# EasyEDA Pro project ProPrj_Hitboard Pro v2.4 左上typec_2026-01-22.epro

# Board PCB1
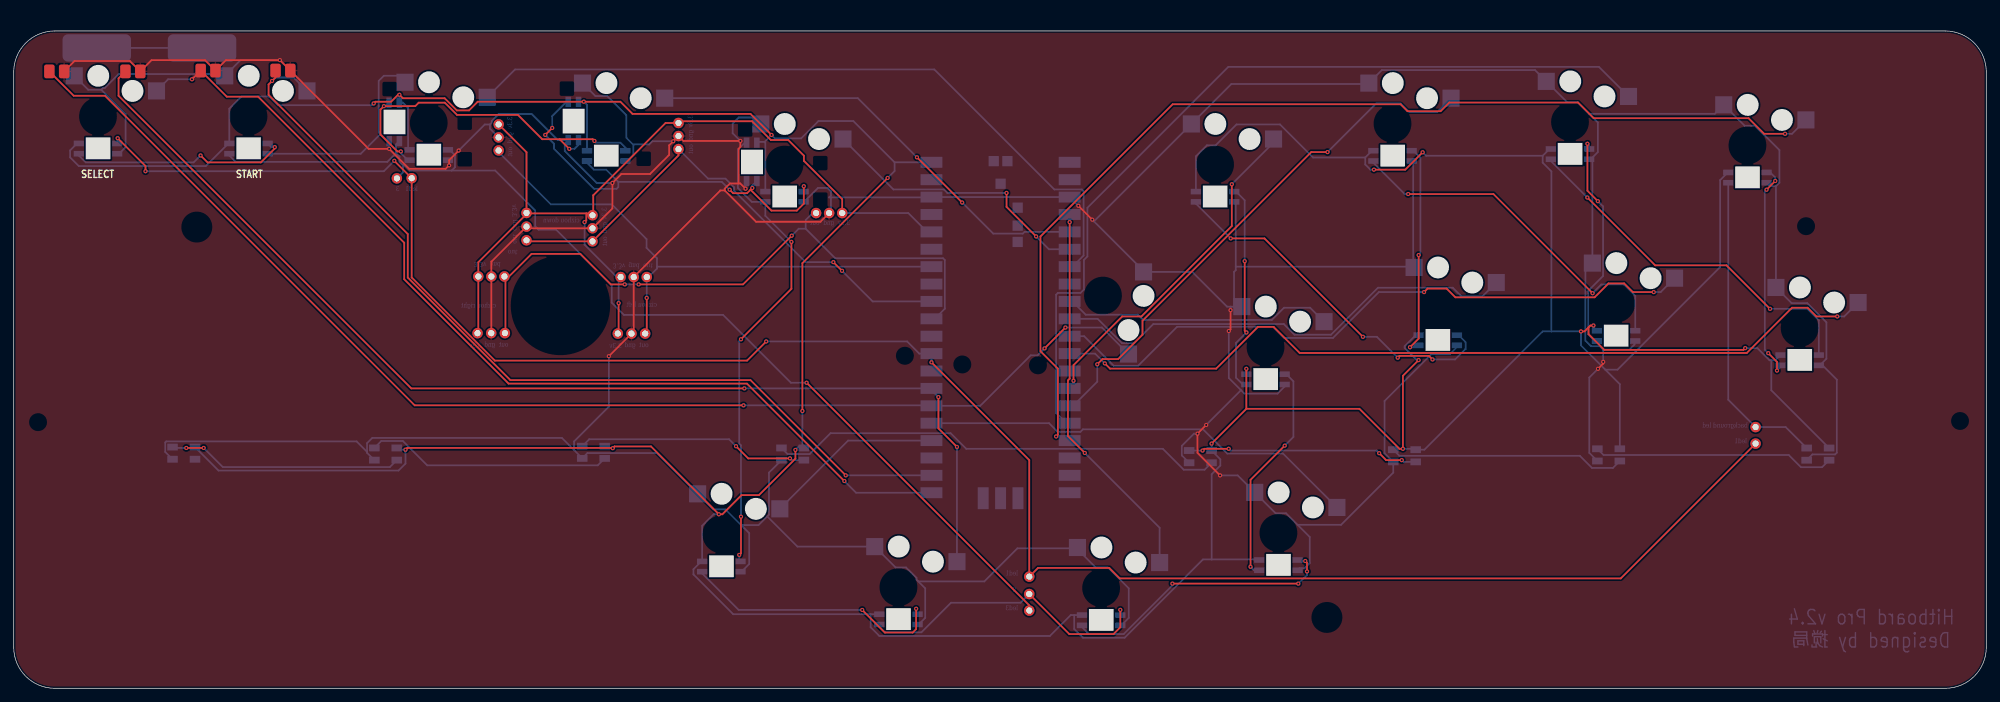
[diagram p0: board, top side]
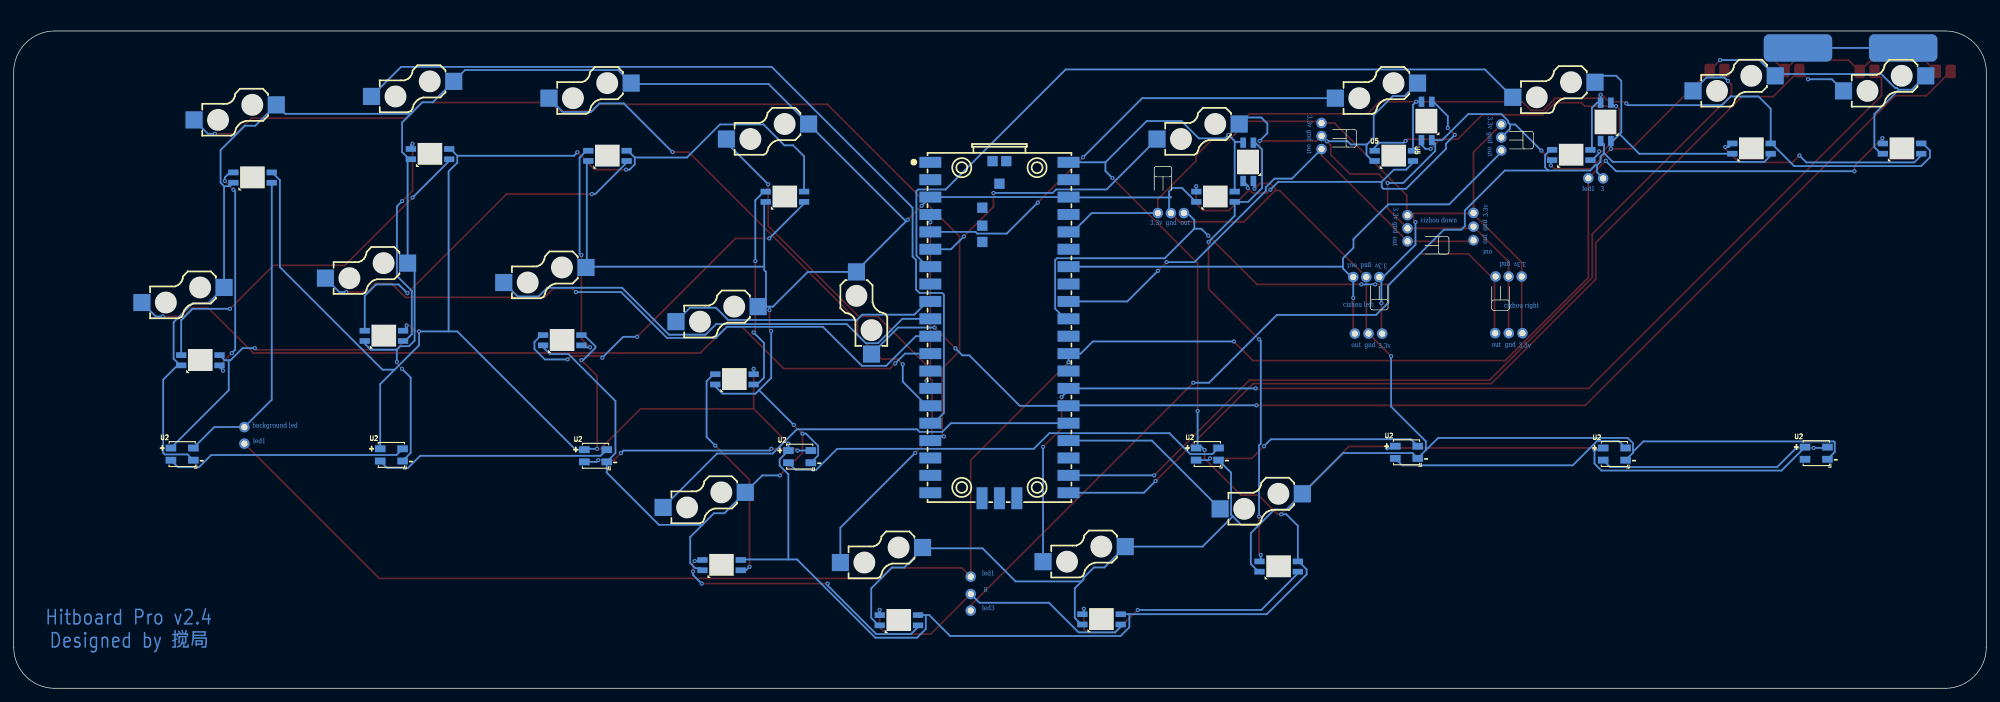
[diagram p1: board, bottom side, seen from below]

Outline 288 x 96 mm; copper layers: Top Layer, Bottom Layer. Coordinates in mm from the lower left corner of the outline.
Outline path: 0,90 arc(1.76,94.24) 6,96 282,96 arc(286.24,94.24) 288,90 288,6 arc(286.24,1.76) 282,0 6,0 arc(1.76,1.76) 0,6 0,90
Stack: Top Layer 0.035mm / Dielectric1 1.51mm FR4 er 4.5 / Bottom Layer 0.035mm

## Design rules (mm)
template: JLCPCB Capability(Two Layers Board)
spacing copperThickness1oz (default): track to track 0.102, other pairs 0.152 to 0.3
spacing copperThickness2oz: track to track 0.203, other pairs 0.152 to 0.3
track width copperThickness1oz (default): min 0.127, default 0.254, max 2.54
track width copperThickness2oz: min 0.203, default 0.254, max 2.54
differential pair differentialPair (default): width min 0.127, default 0.254, max 2.54; gap min 0.152, default 0.152
via viaSize (default): diameter min 0.5, default 0.61, max 10; hole min 0.3, default 0.305, max 6.3

## Placement (name value [footprint] x y rotation side)
NOREF  -  [Pad_e44]  16.32 90.09 0 top
NOREF#2  -  [Pad_e8275]  148.27 13.77 90 top
NOREF#3  -  [Pad_e1080]  119.05 69.4 0 top
NOREF#4  -  [Pad_e81]  27.3 90.22 0 top
NOREF#5  -  [Pad_e77]  67.83 60.14 180 top
NOREF#6  -  [Pad_e71]  88.62 60.06 180 top
NOREF#7  -  [Pad_e115]  97.06 82.56 90 top
NOREF#8  -  [Pad_e7360]  74.87 65.43 270 top
NOREF#9  -  [Pad_e16564]  12.13 93.52 0 top
NOREF#10  -  [Pad_e24566]  58.1 74.5 90 top
NOREF#11  -  [Pad_e79]  71.64 60.14 180 top
NOREF#12  -  [Pad_e7348]  92.19 51.81 0 top
NOREF#13  -  [Pad_e72]  92.43 60.06 180 top
NOREF#14  -  [Pad_e7347]  90.2 51.81 0 top
NOREF#15  -  [Pad_e7353]  69.72 51.87 0 top
NOREF#16  -  [Pad_e56]  7.37 90.09 0 top
NOREF#17  -  [Pad_e117]  97.06 78.75 90 top
NOREF#18  -  [Pad_e116]  97.06 80.66 90 top
NOREF#19  -  [Pad_e121]  70.8 82.36 90 top
NOREF#20  -  [Pad_e8276]  254.32 38.15 90 top
NOREF#21  -  [Pad_e73]  90.52 60.06 180 top
NOREF#22  -  [Pad_e17942]  148.27 11.35 90 top
NOREF#23  -  [Pad_e123]  70.8 78.55 90 top
NOREF#24  -  [Pad_e7361]  74.87 69.42 270 top
NOREF#25  -  [Pad_e7354]  71.71 51.87 0 top
NOREF#26  -  [Pad_e83]  38.23 90.22 0 top
NOREF#27  -  [Pad_e8795]  254.32 35.74 90 top
NOREF#28  -  [Pad_e65]  84.51 67.18 90 top
NOREF#29  -  [Pad_e8272]  55.94 74.47 90 top
NOREF#30  -  [Pad_e78]  69.74 60.14 180 top
NOREF#31  -  [Pad_e122]  70.8 80.45 90 top
NOREF#32  -  [Pad_e7359]  74.87 67.43 270 top
NOREF#33  -  [Pad_e67]  5.21 90.09 0 top
NOREF#34  -  [Pad_e1081]  117.15 69.4 0 top
NOREF#35  -  [Pad_e64]  84.51 65.28 90 top
NOREF#36  -  [Pad_e82]  40.39 90.22 0 top
NOREF#37  -  [Pad_e47]  18.48 90.09 0 top
NOREF#38  -  [Pad_e16566]  27.5 93.52 0 top
NOREF#39  -  [Pad_e7355]  67.72 51.87 0 top
NOREF#40  -  [Pad_e7349]  88.2 51.81 0 top
NOREF#41  -  [Pad_e32726]  148.27 16.31 90 top
NOREF#42  -  [Pad_e66]  84.51 69.09 90 top
NOREF#43  -  [Pad_e80]  29.46 90.22 0 top
NOREF#44  -  [Pad_e1079]  120.96 69.4 0 top
U1  PICO  [COMM-SMD_L51.0-W21.0-P2.54_SC0916]  144.08 52.37 270 bottom
U2  -  [LED-SMD_4P-L3.5-W3.5-TL_WS2812B]  203.05 33.96 180 bottom
U2#2  -  [LED-SMD_4P-L3.5-W3.5-TL_WS2812B]  232.86 34.09 180 bottom
U2#3  -  [LED-SMD_4P-L3.5-W3.5-TL_WS2812B]  173.25 33.83 180 bottom
U2#4  -  [LED-SMD_4P-L3.5-W3.5-TL_WS2812B]  113.73 34.21 180 bottom
U2#5  -  [LED-SMD_4P-L3.5-W3.5-TL_WS2812B]  84.65 34.47 180 bottom
U2#6  -  [LED-SMD_4P-L3.5-W3.5-TL_WS2812B]  54.29 34.21 180 bottom
U2#7  -  [LED-SMD_4P-L3.5-W3.5-TL_WS2812B]  24.83 34.34 180 bottom
U2#8  -  [LED-SMD_4P-L3.5-W3.5-TL_WS2812B]  263.41 34.2 180 bottom
U5  -  [LED-SMD_L3.2-W2.8_YO-WS2812B-3528]  60.59 77.89 180 bottom
U5#2  -  [LED-SMD_L3.2-W2.8_YO-WS2812B-3528]  86.5 77.76 180 bottom
U5#3  -  [LED-SMD_L3.2-W2.8_YO-WS2812B-3528]  112.54 71.79 180 bottom
U5#4  -  [LED-SMD_L3.2-W2.8_YO-WS2812B-3528]  103.31 17.78 180 bottom
U5#5  -  [LED-SMD_L3.2-W2.8_YO-WS2812B-3528]  129.17 10.07 180 bottom
U5#6  -  [LED-SMD_L3.2-W2.8_YO-WS2812B-3528]  158.77 9.94 180 bottom
U5#7  -  [LED-SMD_L3.2-W2.8_YO-WS2812B-3528]  184.65 17.99 180 bottom
U5#8  -  [LED-SMD_L3.2-W2.8_YO-WS2812B-3528]  175.4 71.79 180 bottom
U5#9  -  [LED-SMD_L3.2-W2.8_YO-WS2812B-3528]  182.77 45.12 180 bottom
U5#10  -  [LED-SMD_L3.2-W2.8_YO-WS2812B-3528]  201.31 77.76 180 bottom
U5#11  -  [LED-SMD_L3.2-W2.8_YO-WS2812B-3528]  207.91 50.84 180 bottom
U5#12  -  [LED-SMD_L3.2-W2.8_YO-WS2812B-3528]  227.22 78.01 180 bottom
U5#13  -  [LED-SMD_L3.2-W2.8_YO-WS2812B-3528]  233.95 51.47 180 bottom
U5#14  -  [LED-SMD_L3.2-W2.8_YO-WS2812B-3528]  260.75 47.92 180 bottom
U5#15  -  [LED-SMD_L3.2-W2.8_YO-WS2812B-3528]  253.13 74.59 180 bottom
U5#16  -  [LED-SMD_L3.2-W2.8_YO-WS2812B-3528]  107.75 76.89 90 bottom
U5#17  -  [LED-SMD_L3.2-W2.8_YO-WS2812B-3528]  81.71 82.85 90 bottom
U5#18  -  [LED-SMD_L3.2-W2.8_YO-WS2812B-3528]  55.56 82.73 90 bottom
U5#19  -  [LED-SMD_L3.2-W2.8_YO-WS2812B-3528]  12.31 78.82 180 bottom
U5#20  -  [LED-SMD_L3.2-W2.8_YO-WS2812B-3528]  34.28 78.82 180 bottom
U6  -  [CONN-SMD_HOTPLUGPAKAGE__C9900010116-1]  89.04 87.29 180 bottom
U6#2  -  [CONN-SMD_HOTPLUGPAKAGE__C9900010116-1]  115.08 81.32 180 bottom
U6#3  -  [CONN-SMD_HOTPLUGPAKAGE__C9900010116-1]  105.85 27.31 180 bottom
U6#4  -  [CONN-SMD_HOTPLUGPAKAGE__C9900010116-1]  131.71 19.59 180 bottom
U6#5  -  [CONN-SMD_HOTPLUGPAKAGE__C9900010116-1]  161.31 19.47 180 bottom
U6#6  -  [CONN-SMD_HOTPLUGPAKAGE__C9900010116-1]  187.19 27.51 180 bottom
U6#7  -  [CONN-SMD_HOTPLUGPAKAGE__C9900010116-1]  163.86 54.81 90 bottom
U6#8  -  [CONN-SMD_HOTPLUGPAKAGE__C9900010116-1]  177.94 81.32 180 bottom
U6#9  -  [CONN-SMD_HOTPLUGPAKAGE__C9900010116-1]  185.31 54.65 180 bottom
U6#10  -  [CONN-SMD_HOTPLUGPAKAGE__C9900010116-1]  203.85 87.29 180 bottom
U6#11  -  [CONN-SMD_HOTPLUGPAKAGE__C9900010116-1]  210.45 60.36 180 bottom
U6#12  -  [CONN-SMD_HOTPLUGPAKAGE__C9900010116-1]  229.76 87.54 180 bottom
U6#13  -  [CONN-SMD_HOTPLUGPAKAGE__C9900010116-1]  236.49 61 180 bottom
U6#14  -  [CONN-SMD_HOTPLUGPAKAGE__C9900010116-1]  263.29 57.44 180 bottom
U6#15  -  [CONN-SMD_HOTPLUGPAKAGE__C9900010116-1]  255.67 84.11 180 bottom
U6#16  -  [CONN-SMD_HOTPLUGPAKAGE__C9900010116-1]  14.85 88.35 180 bottom
U6#17  -  [CONN-SMD_HOTPLUGPAKAGE__C9900010116-1]  36.82 88.35 180 bottom
U6#18  -  [CONN-SMD_HOTPLUGPAKAGE__C9900010116-1]  63.13 87.41 180 bottom

## Footprints (pads in the part's own frame, mm; a bottom-side part is the same pattern mirrored in y, then rotated)
COMM-SMD_L51.0-W21.0-P2.54_SC0916
  rect 1.6x3.2 smd: 1(-24.445,-10.088) 2(-21.905,-10.088) 3(-19.365,-10.088) 4(-16.825,-10.088) 5(-14.285,-10.088) 6(-11.745,-10.088) 7(-9.205,-10.088) 8(-6.665,-10.088) 9(-4.125,-10.088) 10(-1.585,-10.088) 11(0.955,-10.088) 12(3.495,-10.088) 13(6.035,-10.088) 14(8.575,-10.088) 15(11.115,-10.088) 16(13.655,-10.088) 17(16.195,-10.088) 18(18.735,-10.088) 19(21.275,-10.088) 20(23.815,-10.088) 21(23.815,10.088) 22(21.275,10.088) 23(18.735,10.088) 24(16.195,10.088) 25(13.655,10.088) 26(11.115,10.088) 27(8.575,10.088) 28(6.035,10.088) 29(3.495,10.088) 30(0.955,10.088) 31(-1.585,10.088) 32(-4.125,10.088) 33(-6.665,10.088) 34(-9.205,10.088) 35(-11.745,10.088) 36(-14.285,10.088) 37(-16.825,10.088) 38(-19.365,10.088) 39(-21.905,10.088) 40(-24.445,10.088)
  rect 3.2x1.6 smd: 41(24.615,-2.54) 42(24.615,0) 43(24.615,2.54)
  rect 1.5x1.5 smd: TP1(-21.315,0) TP2(-24.615,1) TP3(-24.615,-1) TP4(-17.815,-2.5) TP5(-15.188,-2.5) TP6(-12.815,-2.5)
CONN-SMD_HOTPLUGPAKAGE__C9900010116-1
  rect 2.5x2.5 smd: 1(-6,-1.1) 2(6,1.1)
LED-SMD_4P-L3.5-W3.5-TL_WS2812B
  rect 1.545x0.997 smd: 1(-1.637,0.89) 2(-1.637,-0.89) 3(1.637,-0.89) 4(1.637,0.89)
LED-SMD_L3.2-W2.8_YO-WS2812B-3528
  rect 1.5x0.82 smd: 1(2.8,0.75) 2(2.8,-0.75) 3(-2.8,-0.75) 4(-2.8,0.75)
Pad_e44
  rrect 1.524x2 smd: 1(0,0)
Pad_e47
  rrect 1.524x2 smd: 1(0,0)
Pad_e56
  rrect 1.524x2 smd: 1(0,0)
Pad_e64
  round 1.524 hole 0.914: 3(0,0)
Pad_e65
  round 1.524 hole 0.914: 2(0,0)
Pad_e66
  round 1.524 hole 0.914: 1(0,0)
Pad_e67
  rrect 1.524x2 smd: 1(0,0)
Pad_e71
  round 1.524 hole 0.914: 1(0,0)
Pad_e72
  round 1.524 hole 0.914: 3(0,0)
Pad_e73
  round 1.524 hole 0.914: 2(0,0)
Pad_e77
  round 1.524 hole 0.914: 1(0,0)
Pad_e78
  round 1.524 hole 0.914: 2(0,0)
Pad_e79
  round 1.524 hole 0.914: 3(0,0)
Pad_e80
  rrect 1.524x2 smd: 1(0,0)
Pad_e81
  rrect 1.524x2 smd: 1(0,0)
Pad_e82
  rrect 1.524x2 smd: 1(0,0)
Pad_e83
  rrect 1.524x2 smd: 1(0,0)
Pad_e115
  round 1.524 hole 0.914: 1(0,0)
Pad_e116
  round 1.524 hole 0.914: 2(0,0)
Pad_e117
  round 1.524 hole 0.914: 3(0,0)
Pad_e121
  round 1.524 hole 0.914: 1(0,0)
Pad_e122
  round 1.524 hole 0.914: 2(0,0)
Pad_e123
  round 1.524 hole 0.914: 3(0,0)
Pad_e1079
  round 1.524 hole 0.914: 1(0,0)
Pad_e1080
  round 1.524 hole 0.914: 2(0,0)
Pad_e1081
  round 1.524 hole 0.914: 3(0,0)
Pad_e7347
  round 1.524 hole 0.914: 2(0,0)
Pad_e7348
  round 1.524 hole 0.914: 3(0,0)
Pad_e7349
  round 1.524 hole 0.914: 1(0,0)
Pad_e7353
  round 1.524 hole 0.914: 2(0,0)
Pad_e7354
  round 1.524 hole 0.914: 3(0,0)
Pad_e7355
  round 1.524 hole 0.914: 1(0,0)
Pad_e7359
  round 1.524 hole 0.914: 2(0,0)
Pad_e7360
  round 1.524 hole 0.914: 3(0,0)
Pad_e7361
  round 1.524 hole 0.914: 1(0,0)
Pad_e8272
  round 1.524 hole 0.914: 2(0,0)
Pad_e8275
  round 1.524 hole 0.914: 2(0,0)
Pad_e8276
  round 1.524 hole 0.914: 2(0,0)
Pad_e8795
  round 1.524 hole 0.914: 2(0,0)
Pad_e16564
  rrect 10x4 smd far side: 1(0,0)
Pad_e16566
  rrect 10x4 smd far side: 1(0,0)
Pad_e17942
  round 1.524 hole 0.914: 2(0,0)
Pad_e24566
  round 1.524 hole 0.914: 2(0,0)
Pad_e32726
  round 1.524 hole 0.914: 2(0,0)

## Nets
3.3V: NOREF#5.1 NOREF#6.1 NOREF#7.1 NOREF#19.1 NOREF#24.1 NOREF#39.1 NOREF#40.1 NOREF#42.1 NOREF#44.1 U1.36
GND: NOREF#3.2 NOREF#14.2 NOREF#15.2 NOREF#16.1 NOREF#18.2 NOREF#21.2 NOREF#28.2 NOREF#30.2 NOREF#31.2 NOREF#32.2 NOREF#36.1 NOREF#37.1 NOREF#43.1 U1.3 U1.38 U2.3 U2#2.3 U2#3.3 U2#4.3 U2#5.3 U2#6.3 U2#7.3 U2#8.3 U5.3 U5#2.3 U5#3.3 U5#4.3 U5#5.3 U5#6.3 U5#7.3 U5#8.3 U5#9.3 U5#10.3 U5#11.3 U5#12.3 U5#13.3 U5#14.3 U5#15.3 U5#16.3 U5#17.3 U5#18.3 U5#19.3 U5#20.3 U6.2 U6#2.2 U6#3.2 U6#4.2 U6#5.2 U6#6.2 U6#7.2 U6#8.2 U6#9.2 U6#10.2 U6#11.2 U6#12.2 U6#13.2 U6#14.2 U6#15.2 U6#16.2 U6#17.2 U6#18.2
VCC: U1.40 U2.1 U2#2.1 U2#3.1 U2#4.1 U2#5.1 U2#6.1 U2#7.1 U2#8.1 U5.1 U5#2.1 U5#3.1 U5#4.1 U5#5.1 U5#6.1 U5#7.1 U5#8.1 U5#9.1 U5#10.1 U5#11.1 U5#12.1 U5#13.1 U5#14.1 U5#15.1 U5#16.1 U5#17.1 U5#18.1 U5#19.1 U5#20.1
2: U5#19.2 U5#20.4
3: NOREF#22.2 NOREF#29.2 U5.4 U5#18.4 U5#20.2
4: U5.2 U5#2.4 U5#17.4 U5#18.2
5: U5#2.2 U5#3.4 U5#16.4 U5#17.2
6: U5#3.2 U5#4.4 U5#16.2
7: U5#4.2 U5#5.4
8: NOREF#2.2 U5#5.2 U5#6.4
9: U5#6.2 U5#7.4
10: U5#7.2 U5#9.4
11: U5#8.4 U5#9.2
12: U5#8.2 U5#11.4
13: U5#10.4 U5#11.2
14: U5#10.2 U5#13.4
15: U5#12.4 U5#13.2
16: U5#12.2 U5#14.4
17: U5#14.2 U5#15.4
18: NOREF#20.2 U2#8.4 U5#15.2
19: U2#2.4 U2#8.2
20: U2.4 U2#2.2
21: U2.2 U2#3.4
22: U2#3.2 U2#4.4
23: U2#4.2 U2#5.4
24: U2#5.2 U2#6.4
25: U2#6.2 U2#7.4
26: U2#7.2
A: U1.9 U6#9.1
B: U1.10 U6#11.1
CAPTURE: NOREF.1 U1.27 U6#4.1
CI_DOWN: NOREF#8.3 NOREF#17.3 NOREF#35.3 U1.32
CI_LEFT: NOREF#12.3 NOREF#13.3 NOREF#23.3 U1.34
CI_RIGHT: NOREF#11.3 NOREF#25.3 NOREF#34.3 U1.31
DOWN: U1.5 U6.1
GUDING1: NOREF#9.1 NOREF#38.1
HOME: NOREF#33.1 U1.26 U6#7.1
L3: U1.24 U6#3.1
LB: U1.17 U6#15.1
LED1: NOREF#10.2 NOREF#27.2 NOREF#41.2 U1.29 U5#19.4
LEFT: U1.7 U6#18.1
LT: U1.12 U6#14.1
R3: U1.25 U6#6.1
RB: U1.16 U6#12.1
RIGHT: U1.6 U6#2.1
RT: U1.11 U6#13.1
SELECT: NOREF#4.1 U1.21 U6#16.1
START: NOREF#26.1 U1.22 U6#17.1
UP: U1.4 U6#5.1
X: U1.14 U6#8.1
Y: U1.15 U6#10.1

Pads without a net: U1 1 2 8 13 18 19 20 23 28 30 33 35 37 39 41 42 43 TP1 TP2 TP3 TP4 TP5 TP6

## Via types
v1: diameter 0.61, hole 0.305, Top Layer to Bottom Layer, 127 vias

## Routing (per net, layer and track width the routed paths; a pad name or vN(x,y) marks a point on that pad's centre or on a via; arc(x,y) is an arc through that point)
3.3V: length 130.2
  Top Layer w0.254: 84.61,69.35 83.6,69.35 ; 84.61,69.35 84.61,69.2 NOREF#42.1 ; 84.61,69.35 84.61,72 95.18,82.56 NOREF#7.1 97.31,82.82 107.8,82.82 110.55,80.07 113.09,80.07 115.37,77.79 115.37,77.02 120.96,71.44 NOREF#44.1 ; 83.6,69.35 83.6,68.34 v1(83.34,68.08) ; 83.6,69.35 74.96,69.35 ; NOREF#40.1 88.32,51.92 v1(88.32,56.25) ; 74.96,69.35 NOREF#24.1 74.87,78.29 NOREF#19.1 ; 74.96,69.35 67.83,62.22 NOREF#5.1 67.83,51.98 NOREF#39.1
  Bottom Layer w0.254: 88.32,60.06 88.07,60.06 83.34,64.78 v1(83.34,68.08) ; 88.32,60.06 v1(88.32,56.25) ; 88.32,60.06 NOREF#6.1 ; NOREF#44.1 130.61,69.4 133.36,66.66 U1.36
GND: length 1010.9
  Top Layer w0.254: 105.84,73.72 104.57,73.72 103.81,72.96 103.81,72.71 ; 105.84,73.72 106.09,73.72 v1(106.85,72.96) ; 105.84,73.72 105.84,78.8 106.09,79.06 v1(106.09,79.94) 97.78,79.94 NOREF#18.2 v1(96.3,79.89) 95.7,79.29 95.7,77.9 92.9,75.11 88.72,75.11 v1(87.41,73.8) 87.41,70.08 NOREF#28.2 75.12,67.18 NOREF#32.2 69.74,62.3 NOREF#30.2 69.74,51.89 NOREF#15.2 ; v1(231.31,46.66) 232.07,47.42 v1(232.07,47.67) ; v1(174.1,38.46) v1(172.83,37.19) 172.83,34.4 v1(176.13,31.09) ; v1(177.66,55.22) 177.66,52.43 v1(177.41,52.18) ; 103.81,72.71 103.17,72.71 NOREF#21.2 90.52,52.13 NOREF#14.2 v1(86.9,48.5) ; 103.81,72.71 108.38,68.13 117.78,68.13 NOREF#3.2 ; v1(155.44,70.47) v1(157.47,68.44) ; v1(64.96,78.53) 63.57,77.14 v1(63.57,76.38) 63.06,75.87 57.73,75.87 v1(54.81,78.78) 51.83,78.78 NOREF#36.1 v1(38.86,91.74) 30.98,91.74 NOREF#43.1 27.93,91.74 20.13,91.74 NOREF#37.1 16.96,91.62 8.89,91.62 NOREF#16.1
  Bottom Layer w0.254: v1(106.09,79.94) 104.97,81.06 104.97,82.47 105.86,83.36 108.13,83.36 U6#2.2 ; 178.17,55.73 178.17,60.81 178.42,61.07 178.42,61.57 ; 178.17,55.73 179.29,55.73 U6#9.2 ; 178.17,55.73 177.66,55.73 ; 230.02,83.9 248.36,83.9 U6#15.2 252.71,82.16 254.24,82.16 257.79,78.61 257.79,73.84 257.29,73.33 ; 230.02,83.9 231.29,82.63 231.29,78.32 230.27,77.3 ; 230.02,83.9 228.33,85.59 226.81,85.59 U6#12.2 222.11,90.29 199.75,90.29 197.72,88.26 177.78,88.26 U6#8.2 157.73,68.2 157.73,68.18 ; 53.54,80.94 50.67,78.07 U5#20.3 ; 53.54,80.94 54.56,79.93 U5#18.3 v1(54.81,78.78) ; 53.54,80.94 53.29,81.2 53.29,88.71 54.04,89.46 56.19,89.46 57.13,88.51 ; U6#11.2 204.34,61.57 204.08,61.57 ; 69.53,82.34 69.79,82.59 69.79,82.85 70.8,83.86 75.63,83.86 79.44,80.05 U5#17.3 80.46,79.55 80.46,78.46 85.12,73.8 v1(87.41,73.8) ; 69.53,82.34 69.53,81.72 NOREF#31.2 ; 69.53,82.34 68.77,82.34 v1(64.96,78.53) ; 12.78,87.42 16.34,83.86 16.34,79.03 15.38,78.07 U5#19.3 ; 12.78,87.42 10.88,87.42 U6#16.2 ; 12.78,87.42 13.04,87.67 13.29,87.67 15.32,89.7 30.56,89.7 U6#17.2 33.11,91.74 v1(38.86,91.74) ; U5#7.3 187.73,17.53 188.46,17.53 189.22,18.29 189.22,22.1 187.44,23.88 ; 155.18,20.44 U6#5.2 ; 155.18,20.44 146.54,20.44 141.72,15.61 132.06,15.61 ; 155.18,20.44 157.97,17.65 159.75,17.65 162.8,14.6 162.8,10.28 161.71,9.19 U5#6.3 ; 119.31,71.69 119.05,71.69 119.32,71.96 119.32,72.57 118.81,73.08 117.43,73.08 115.54,71.18 115.48,71.18 U5#3.3 ; 119.31,71.69 119.32,71.68 119.32,69.67 NOREF#3.2 ; 119.31,71.69 133.95,71.69 U1.38 U1.3 v1(155.44,70.47) ; U5.3 63.57,76.96 v1(63.57,76.38) ; 179.18,43.54 177.41,45.32 v1(177.41,52.18) ; 179.18,43.54 v1(174.1,38.46) ; 179.18,43.54 179.69,43.03 184.52,43.03 185.57,44.08 U5#9.3 ; v1(157.47,68.44) 157.73,68.18 ; 157.73,68.18 164.96,60.95 U6#7.2 172.07,60.81 177.15,55.73 177.66,55.73 ; U2#3.3 170.55,34.01 170.55,35.41 172.33,37.19 v1(172.83,37.19) ; 263.89,47.36 263.75,47.36 U5#14.3 ; 263.89,47.36 264.65,48.13 264.65,53.46 261.86,56.25 259.57,56.25 U6#14.2 257.29,73.33 ; 263.89,47.36 266.18,45.08 266.18,34.41 265.92,34.16 262.61,34.16 U2#8.3 ; 177.66,55.73 v1(177.66,55.22) ; U5#16.3 106.85,73.94 v1(106.85,72.96) ; 132.06,15.61 133.08,14.6 133.08,10.28 132.12,9.32 U5#5.3 ; 132.06,15.61 131.81,15.87 131.81,16.12 130.29,17.65 128.76,17.65 U6#4.2 114.43,20.69 110.01,25.11 ; U2#6.3 51.59,34.39 51.59,34.53 ; 83.01,33.59 U2#5.3 ; 83.01,33.59 81.82,34.79 ; 83.01,33.59 83.77,34.36 93.91,34.36 U6#3.2 102.14,26.12 103.92,26.12 106.2,23.84 ; 90.49,79.35 90.49,77.89 89.61,77.01 U5#2.3 ; 90.49,79.35 90.49,79.43 92.78,79.43 93.25,79.89 v1(96.3,79.89) ; 90.49,79.35 89.44,80.4 89.44,83.7 86.65,86.5 84.93,86.5 U6.2 ; v1(176.13,31.09) 178.7,31.09 U6#6.2 184.23,25.57 185.76,25.57 187.44,23.88 ; 51.59,34.53 50.07,36.06 22.27,36.06 22.13,35.91 22.13,34.52 U2#7.3 ; 51.59,34.53 51.59,35.8 52.35,36.57 80.04,36.57 81.82,34.79 ; 106.2,23.84 108.74,23.84 110.01,25.11 ; 106.2,23.84 107.38,22.66 107.38,18.16 106.26,17.03 U5#4.3 ; 178.42,61.57 204.08,61.57 ; 178.42,61.57 178.42,70.82 U5#8.3 ; 110.01,25.11 110.27,25.36 110.27,31.5 U2#4.3 ; 230.27,77.3 230.05,77.3 U5#12.3 ; 230.27,77.3 230.49,77.08 U6#13.2 229.47,61.08 229.47,50.78 230.29,49.96 231.56,49.96 232.07,49.45 ; U2#2.3 230.04,34.38 230.04,45.39 v1(231.31,46.66) ; 232.07,49.45 v1(232.07,47.67) ; 232.07,49.45 235.88,49.45 236.64,50.21 236.64,50.61 U5#13.3 ; 187.44,23.88 193.8,23.88 201.41,31.5 U2.3 200.15,34.34 200.15,41.96 207,48.82 209.7,48.82 210.71,49.83 U5#11.3 ; U5#10.3 204.33,76.79 204.33,61.83 204.08,61.57 ; 81.82,34.79 81.82,36.06 86.9,41.14 v1(86.9,48.5) ; 257.29,73.33 256.43,73.33 U5#15.3
VCC: length 741.6
  Top Layer w0.254: v1(52.56,85.41) 52.81,85.67 55.1,85.67 56.11,86.68 v1(56.31,86.68) 56.82,86.18 62.92,86.18 64.7,84.4 66.47,84.4 67.74,85.67 v1(83.24,85.67) 88.57,85.67 90.35,83.89 107.57,83.89 v1(110.64,80.81) ; v1(127.59,74.53) 115.15,62.09 v1(115.15,40.5) ; v1(230.64,52.98) 230.19,52.98 229.94,52.73 ; 229.94,52.73 229.94,51.71 232.22,49.43 252.54,49.43 v1(252.8,49.68) ; 229.94,52.73 229.33,52.12 v1(228.82,52.12) ; 179.97,40.82 v1(179.97,46.66) ; 179.97,40.82 v1(174.89,35.74) ; 179.97,40.82 196.48,40.82 202.32,34.98 v1(202.83,34.98) 202.83,45.64 v1(205.11,47.93) ; v1(57.2,34.85) 57.45,35.1 87.43,35.1 v1(87.46,35.07) 87.72,35.32 93.05,35.32 v1(102.96,25.42) 103.46,25.42 106.26,28.21 108.8,28.21 114.13,33.54 v1(114.13,34.81) ; v1(198.59,75.74) 203.17,75.74 v1(205.71,78.28)
  Bottom Layer w0.254: v1(56.31,86.68) U5#18.1 56.82,85.53 57.58,84.77 57.58,78.85 U5.1 ; U5#7.1 181.76,18.82 174.9,18.82 ; 197.32,77.52 197.32,76.51 198.09,75.74 v1(198.59,75.74) ; 197.32,77.52 189.7,77.52 184.88,82.35 178.53,82.35 175.48,79.3 174.21,79.3 172.6,77.69 U5#8.1 ; 197.32,77.52 198.31,78.51 U5#10.1 ; 115.15,35.32 114.64,35.32 v1(114.13,34.81) ; 115.15,35.32 U2#4.1 ; 115.15,35.32 v1(115.15,40.5) ; v1(174.89,35.74) U2#3.1 176.17,33.44 176.17,32.54 174.9,31.27 174.9,18.82 ; 128.61,76.82 U1.40 ; 128.61,76.82 122.58,82.85 117.5,82.85 114.96,80.31 111.15,80.31 v1(110.64,80.81) 109.63,79.8 ; 128.61,76.82 128.61,75.55 v1(127.59,74.53) ; U2#7.1 29.9,31.8 56.18,31.8 57.2,32.82 v1(57.2,34.85) 56.18,34.85 U2#6.1 ; U5#3.1 109.74,79.69 109.63,79.8 ; U5#19.1 9.25,79.57 8.24,78.56 8.24,77.54 9.51,76.27 28.05,76.27 31.35,79.57 U5#20.1 31.48,84.65 33.25,86.43 37.32,86.43 38.59,85.16 52.3,85.16 v1(52.56,85.41) ; U2#5.1 86.57,35.07 v1(87.46,35.07) ; 154.83,10.69 154.33,10.69 151.28,7.64 126.39,7.64 125.12,8.91 125.12,10.82 ; 154.83,10.69 154.83,8.66 156.1,7.39 162.2,7.39 173.63,18.82 174.9,18.82 ; 154.83,10.69 U5#6.1 ; 232.38,46.53 234.15,46.53 249.14,61.52 249.14,74.22 250.04,75.12 250.11,75.12 U5#15.1 ; 232.38,46.53 228.82,50.09 v1(228.82,52.12) 224.5,52.12 ; 232.38,46.53 234.49,44.42 U2#2.1 ; v1(205.71,78.28) 206.21,77.78 223.23,77.78 ; U5#13.1 230.64,52.73 v1(230.64,52.98) ; 256.61,47.9 257.18,47.9 U5#14.1 ; 256.61,47.9 256.35,47.9 254.57,49.68 v1(252.8,49.68) ; 256.61,47.9 256.61,43.53 U2#8.1 ; U5#11.1 205.01,51.49 204.61,51.49 203.08,49.96 203.08,49.71 204.86,47.93 v1(205.11,47.93) ; U5#16.1 108.61,79.8 109.63,79.8 ; 100.51,18.66 U5#4.1 ; 100.51,18.66 100.51,23.74 102.19,25.42 v1(102.96,25.42) ; 100.51,18.66 99.24,17.39 99.24,16.62 105.05,10.82 125.12,10.82 ; 125.12,10.82 U5#5.1 ; U5#17.1 82.48,85.67 v1(83.24,85.67) 83.7,85.2 U5#2.1 ; U5#12.1 224.22,78.76 223.23,77.78 ; 223.23,77.78 223.23,76.76 224.5,75.49 224.5,52.12 ; 224.5,52.12 223.23,52.12 205.96,34.85 204.69,34.85 204.56,34.98 v1(202.83,34.98) ; v1(179.97,46.66) U5#9.1
2: length 32.4
  Top Layer w0.254: v1(38.12,79.04) 38.12,78.83 36.09,76.8 28.3,76.8 v1(27.29,77.82)
  Bottom Layer w0.254: U5#19.2 9.51,77.82 10.52,76.8 26.27,76.8 v1(27.29,77.82) ; U5#20.4 37.61,79.04 v1(38.12,79.04)
3: length 157.4
  Top Layer w0.254: NOREF#22.2 148.27,12.12 v1(115.76,44.63)
  Bottom Layer w0.254: 63.95,75.62 64.42,76.09 64.42,77.86 63.74,78.55 63.49,78.55 U5.4 ; 63.95,75.62 70.3,75.62 76.14,69.77 76.14,67.49 76.65,66.98 79.19,66.98 87.31,58.85 87.31,56.31 89.09,54.53 103.57,54.53 113.48,44.63 v1(115.76,44.63) ; 63.95,75.62 57.85,75.62 57.09,76.38 56.83,76.38 ; 55.82,78.16 56.33,77.65 56.33,76.89 56.83,76.38 ; 55.82,78.16 55.82,79.43 U5#18.4 ; 55.82,78.16 54.55,76.89 32.41,76.89 31.48,77.82 U5#20.2 ; 56.83,76.38 56.83,75.36 NOREF#29.2
4: length 54.2
  Top Layer w0.254: 79.71,80.19 77.17,80.19 73.61,83.75 64.72,83.75 62.94,85.53 59.13,85.53 58.62,85.02 v1(54.05,85.02) 53.54,84.51 53.54,80.88 56.02,78.41 v1(56.52,78.41) ; 79.71,80.19 v1(81.11,78.78) ; 79.71,80.19 84.53,80.19 v1(84.79,79.94)
  Bottom Layer w0.254: U5#17.4 82.38,79.97 82.38,79.29 81.88,78.78 v1(81.11,78.78) ; U5#2.4 89.3,78.98 88.6,79.68 85.04,79.68 v1(84.79,79.94) ; U5#18.2 54.31,85.02 v1(54.05,85.02) ; U5.2 57.54,77.14 56.52,78.15 v1(56.52,78.41)
5: length 62.2
  Top Layer w0.254: v1(77.61,80.82) v1(78.62,81.84) ; 107.58,72.82 v1(107.83,73.07) ; 107.58,72.82 107.07,72.31 105.04,72.31 v1(104.53,72.82) ; 107.58,72.82 110.63,69.77 114.34,69.77 115.36,70.78 v1(115.36,73.32)
  Bottom Layer w0.254: 88.27,73.96 88.27,73.2 88.02,72.95 84.72,72.95 78.88,78.79 78.88,79.55 v1(77.61,80.82) ; 88.27,73.96 86.5,75.74 84.72,75.74 83.7,76.76 U5#2.2 ; 88.27,73.96 103.38,73.96 v1(104.53,72.82) ; v1(107.83,73.07) 107.83,73.42 U5#16.4 ; v1(78.62,81.84) 78.62,83.57 80.7,85.65 80.96,85.65 U5#17.2 ; v1(115.36,73.32) 115.36,72.56 U5#3.4
6: length 69.7
  Top Layer w0.254: v1(105.93,19.48) 106.18,19.73 v1(106.18,25.07) ; v1(113.55,65.2) 113.55,58.34 v1(106.18,50.98)
  Bottom Layer w0.254: v1(106.18,50.98) 105.93,50.72 105.93,35.74 106.18,35.48 v1(106.18,25.07) ; U5#16.2 106.75,79.69 105.73,78.67 105.73,73.07 107.76,71.04 U5#3.2 109.74,69.01 v1(113.55,65.2) ; U5#4.4 105.93,18.72 v1(105.93,19.48)
7: length 39.1
  Top Layer w0.254: v1(131.76,11.62) 131.76,8.65 131.25,8.14 127.18,8.14 v1(123.88,11.44)
  Bottom Layer w0.254: U5#5.4 131.76,11.04 v1(131.76,11.62) ; U5#4.2 100.51,16.78 105.85,11.44 v1(123.88,11.44)
8: length 44.3
  Top Layer w0.254: NOREF#2.2 154.12,7.92 160.58,7.92 161.56,8.91 v1(161.56,11.45)
  Bottom Layer w0.254: NOREF#2.2 147,12.5 136.84,12.5 132.53,8.18 127.19,8.18 126.37,9 U5#5.2 ; v1(161.56,11.45) U5#6.4
9: length 40.6
  Top Layer w0.254: v1(188.57,18.59) 188.82,18.34 v1(188.82,17.07) ; v1(169.17,15.29) v1(187.55,15.29)
  Bottom Layer w0.254: v1(187.55,15.29) 188.82,16.56 v1(188.82,17.07) ; v1(169.17,15.29) 169.17,15.03 162.06,7.92 156.98,7.92 155.97,8.94 U5#6.2 ; v1(188.57,18.59) 187.59,18.59 U5#7.4
10: length 32.9
  Top Layer w0.254: v1(180.58,17.75) 180.58,30.45 v1(185.57,35.44)
  Bottom Layer w0.254: v1(185.57,35.44) 186.84,36.71 186.84,44.84 185.8,45.87 U5#9.4 ; v1(180.58,17.75) 181.08,17.24 U5#7.2
11: length 30.6
  Top Layer w0.254: v1(179.98,51.97) 179.73,52.22 v1(179.73,62.38)
  Bottom Layer w0.254: U5#9.2 179.45,44.37 178.46,45.36 178.46,50.44 v1(179.98,51.97) ; U5#8.4 178.46,72.54 179.73,71.27 v1(179.73,62.38)
12: length 52.6
  Top Layer w0.254: v1(207.15,48.03) 206.64,48.54 202.32,48.54 v1(202.07,48.28) ; v1(196.99,51.33) 182.61,65.71 v1(177.68,65.71)
  Bottom Layer w0.254: U5#8.2 172.6,70.79 v1(177.68,65.71) ; v1(202.07,48.28) 199.02,51.33 v1(196.99,51.33) ; U5#11.4 210.96,51.59 211.97,50.57 211.97,49.55 210.45,48.03 v1(207.15,48.03)
13: length 31.4
  Top Layer w0.254: v1(203.86,49.81) 205.13,51.08 v1(205.13,63.27)
  Bottom Layer w0.254: v1(205.13,63.27) 205.38,63.52 205.38,77.49 204.36,78.51 U5#10.4 ; U5#11.2 204.84,49.81 v1(203.86,49.81)
14: length 52.7
  Top Layer w0.254: v1(230.51,57.71) 216.04,72.18 v1(203.59,72.18)
  Bottom Layer w0.254: v1(203.59,72.18) 203.08,72.18 198.51,76.76 U5#10.2 ; v1(230.51,57.71) 231.78,58.98 235.09,58.98 236.75,57.31 U5#13.4
15: length 32.2
  Top Layer w0.254: v1(229.76,79.53) 229.76,72.67 v1(231.29,71.14)
  Bottom Layer w0.254: v1(231.29,71.14) 232.05,70.38 232.05,60.22 229.88,58.05 229.88,51.7 230.86,50.72 U5#13.2 ; v1(229.76,79.53) 230.02,79.27 U5#12.4
16: length 54.1
  Top Layer w0.254: v1(256.42,55.42) 250.07,61.77 239.66,61.77 v1(229.75,71.68)
  Bottom Layer w0.254: v1(256.42,55.42) 261.87,55.42 263.55,53.75 U5#14.4 ; v1(229.75,71.68) 224.42,77.01 U5#12.2
17: length 32.1
  Top Layer w0.254: v1(256.17,48.94) 257.44,47.67 v1(257.44,46.4) ; v1(255.91,72.82) v1(257.18,74.09)
  Bottom Layer w0.254: v1(257.44,46.4) 257.95,46.91 U5#14.2 ; v1(256.17,48.94) 255.66,49.45 255.66,72.57 v1(255.91,72.82) ; v1(257.18,74.09) 257.18,74.6 256.45,75.34 U5#15.4
18: length 46.1
  Bottom Layer w0.254: U2#8.4 258.71,38.15 NOREF#20.2 250.33,42.14 U5#15.2
19: length 35.4
  Bottom Layer w0.254: U2#2.4 232.12,34.07 259.16,34.07 260.94,32.29 264.03,32.29 U2#8.2
20: length 34.6
  Bottom Layer w0.254: U2.4 202.31,33.96 228.65,33.96 230.43,32.18 233.48,32.18 U2#2.2
21: length 34
  Top Layer w0.254: v1(177.38,34.98) 173.83,34.98 v1(173.57,34.72) ; v1(202.66,33.32) 200.37,33.32 v1(199.36,34.34)
  Bottom Layer w0.254: 204.69,33.07 202.91,33.07 v1(202.66,33.32) ; v1(199.36,34.34) 198.97,34.72 177.64,34.72 v1(177.38,34.98) ; v1(173.57,34.72) U2#3.4
22: length 67.1
  Bottom Layer w0.254: U2#4.4 112.98,34.21 116.21,34.21 119.26,37.26 136.79,37.26 139.07,34.97 167.78,34.97 170.82,31.93 173.87,31.93 U2#3.2
23: length 34
  Top Layer w0.254: v1(105.46,35.36) 107.24,33.58 v1(113.34,33.58)
  Bottom Layer w0.254: U2#4.2 113.59,33.32 v1(113.34,33.58) ; v1(105.46,35.36) 104.45,36.37 84.02,36.37 U2#5.4
24: length 35.9
  Bottom Layer w0.254: U2#6.4 53.67,36.12 56.82,36.12 60.38,32.56 85.27,32.56 U2#5.2
25: length 34.4
  Top Layer w0.254: v1(27.74,35.1) v1(25.2,35.1)
  Bottom Layer w0.254: U2#7.4 23.32,35.1 v1(25.2,35.1) ; U2#6.2 54.91,32.31 30.53,32.31 v1(27.74,35.1)
A: length 39.8
  Bottom Layer w0.254: U1.9 154.57,56.5 156.51,54.56 164.13,54.56 164.89,53.8 183.69,53.8 185.47,55.58 189.28,55.58 191.31,53.55
B: length 69.8
  Bottom Layer w0.254: U1.10 158.26,53.96 161.81,50.4 163.59,50.4 166.38,53.2 185.43,53.2 186.99,51.64 192.32,51.64 199.18,58.5 210.1,58.5 211.37,57.23 214.42,57.23 U6#11.1
CAPTURE: length 167.2
  Top Layer w0.254: v1(135.01,42.53) 135.01,37.96 v1(137.71,35.25) ; v1(106.68,43.8) 58.04,43.8 15.3,86.54 15.3,89.08 NOREF.1
  Bottom Layer w0.254: v1(137.71,35.25) 137.71,18.49 ; v1(135.01,42.53) 134,43.55 U1.27 v1(106.68,43.8)
CI_DOWN: length 74.8
  Top Layer w0.254: v1(119.67,62.24) v1(120.94,60.97) ; NOREF#8.3 75.03,65.28 NOREF#35.3 97.06,77.83 NOREF#17.3
  Bottom Layer w0.254: U1.32 125.41,56.5 v1(120.94,60.97) ; NOREF#17.3 101.38,74.43 103.92,74.43 105.19,73.16 105.19,72.66 115.6,62.24 v1(119.67,62.24)
CI_LEFT: length 82.5
  Top Layer w0.254: v1(92.43,57.01) 92.43,52.04 NOREF#12.3
  Bottom Layer w0.254: NOREF#23.3 70.8,78.3 78.42,70.68 87.31,70.68 92.39,65.6 92.39,64.33 93.92,62.8 93.92,61.53 ; v1(92.43,57.01) NOREF#13.3 92.68,60.06 93.92,61.3 93.92,61.53 ; 93.92,61.53 93.97,61.58 U1.34
CI_RIGHT: length 94
  Top Layer w0.254: v1(91.24,58.99) 106.48,58.99 v1(113.59,66.1) ; NOREF#25.3 71.8,51.95 71.8,60.14 ; v1(89.21,58.99) 87.18,58.99 82.72,63.45 75.61,63.45 72.31,60.14 71.8,60.14 ; 71.8,60.14 NOREF#11.3
  Bottom Layer w0.254: 115.62,67.12 115.62,68.39 116.64,69.4 NOREF#34.3 ; 115.62,67.12 119.94,62.8 135.69,62.8 135.94,62.55 135.94,55.43 134.47,53.96 U1.31 ; 115.62,67.12 114.61,67.12 v1(113.59,66.1) ; v1(91.24,58.99) v1(89.21,58.99)
DOWN: length 67.4
  Top Layer w0.254: v1(131.87,77.55) v1(138.48,70.95)
  Bottom Layer w0.254: U1.5 147.59,66.66 147.33,66.41 143.02,66.41 v1(138.48,70.95) ; v1(131.87,77.55) 123.24,86.19 U6.1
GUDING1: length 15.4
  Bottom Layer w0.254: NOREF#9.1 NOREF#38.1
HOME: length 184.1
  Top Layer w0.254: NOREF#33.1 8.76,86.54 13.34,86.54 58.55,41.33 v1(106.55,41.33) ; v1(150.5,49.64) v1(153.55,52.69)
  Bottom Layer w0.254: v1(106.55,41.33) 133.93,41.33 U1.26 141.11,41.26 148.47,48.63 149.49,48.63 v1(150.5,49.64) ; U6#7.1 158.88,52.69 v1(153.55,52.69)
L3: length 26.3
  Bottom Layer w0.254: U1.24 121.83,36.18 U6#3.1
LB: length 156
  Top Layer w0.254: v1(258.62,80.98) 255.57,80.98 253.28,83.26 230.68,83.26 228.39,85.55 209.6,85.55 208.33,84.28 203.5,84.28 202.48,85.3 169.21,85.3 149.91,65.99 149.91,49.23 152.45,46.69 152.45,37.04 v1(152.19,36.78)
  Bottom Layer w0.254: v1(258.62,80.98) 259.63,80.98 261.67,83.01 ; U1.17 153.57,36.78 v1(152.19,36.78)
LED1: length 299
  Top Layer w0.254: v1(15.18,80.34) 19.24,76.28 v1(19.24,75.51) ; NOREF#27.2 234.63,16.05 161.48,16.05 159.96,17.58 149.54,17.58 NOREF#41.2 148.27,33.32 v1(134,47.6) ; v1(55.56,77.04) NOREF#10.2 58.1,60 70.24,47.86 107.07,47.86 v1(109.87,50.66)
  Bottom Layer w0.254: v1(109.87,50.66) 130.44,50.66 132.22,48.88 U1.29 v1(134,47.6) ; v1(15.18,80.34) 15.18,79.64 U5#19.4 ; v1(19.24,75.51) 54.04,75.51 v1(55.56,77.04)
LEFT: length 108.2
  Bottom Layer w0.254: U1.7 154.58,61.58 156.2,63.2 156.2,72.6 155.95,72.85 151.94,72.85 134.41,90.38 73.2,90.38 U6#18.1
LT: length 124.2
  Top Layer w0.254: v1(266.24,54.31) 263.19,54.31 261.92,55.58 259.63,55.58 253.03,48.97 187.75,48.97 183.94,52.78 181.66,52.78 175.56,46.69 160.07,46.69 v1(159.3,47.45)
  Bottom Layer w0.254: v1(266.24,54.31) 267.25,54.31 U6#14.1 ; U1.12 157.87,48.88 v1(159.3,47.45)
R3: length 64.6
  Bottom Layer w0.254: U6#6.1 185.31,34.29 177.18,34.29 173.65,37.82 156.11,37.82 155.73,37.45 152.43,37.45 151.16,38.72 U1.25
RB: length 125.7
  Bottom Layer w0.254: U1.16 153.68,38.72 152.19,40.21 152.19,57.48 152.45,57.74 155.75,57.74 156.26,58.25 156.26,62.56 156.76,63.07 156.76,70.18 177.34,90.76 231.44,90.76 U6#12.1
RIGHT: length 41
  Top Layer w0.254: v1(149.27,65.99) 144.95,70.31 v1(144.95,72.34)
  Bottom Layer w0.254: U1.6 151.14,64.12 v1(149.27,65.99) ; v1(144.95,72.34) 136.32,72.34 135.81,72.85 128.44,72.85 U6#2.1
RT: length 98.9
  Top Layer w0.254: v1(239.44,57.86) 236.39,57.86 235.12,59.13 232.84,59.13 230.81,57.1 210.49,57.1 209.22,58.37 206.42,58.37 v1(205.91,57.86)
  Bottom Layer w0.254: U1.11 156.29,51.42 160.61,47.1 164.16,47.1 169.85,52.79 183.87,52.79 185.5,51.17 192.61,51.17 199.31,57.86 v1(205.91,57.86) ; v1(239.44,57.86) 240.46,57.86 U6#13.1
SELECT: length 143
  Top Layer w0.254: v1(121.28,30.27) 107.05,44.5 72.26,44.5 57.02,59.74 57.02,65.07 35.68,86.41 31.11,86.41 NOREF#4.1 v1(26.03,88.95)
  Bottom Layer w0.254: U6#16.1 22.55,88.95 v1(26.03,88.95) ; U1.21 122.99,28.56 v1(121.28,30.27)
START: length 133.6
  Top Layer w0.254: NOREF#26.1 38.23,89.2 v1(37.72,88.7) 37.21,88.19 37.21,86.66 57.53,66.34 57.53,59.99 72.52,45.01 107.57,45.01 v1(121.48,31.1)
  Bottom Layer w0.254: v1(121.48,31.1) U1.22 ; v1(37.72,88.7) 38.23,89.2 40.86,89.2 U6#17.1
UP: length 56.5
  Top Layer w0.254: v1(156.38,34.37) 153.92,36.84 153.92,44.96 154.17,45.22 v1(154.17,68.08)
  Bottom Layer w0.254: v1(154.17,68.08) U1.4 ; U6#5.1 167.31,23.45 v1(156.38,34.37)
X: length 50.4
  Top Layer w0.254: v1(154.73,44.91) 154.73,47.2 161.84,54.31 164.64,54.31 177.85,67.52 v1(177.85,73.61)
  Bottom Layer w0.254: v1(154.73,44.91) 154.73,44.36 U1.14 ; v1(177.85,73.61) 183.94,79.71 U6#8.1
Y: length 78
  Top Layer w0.254: v1(158.2,47.32) 158.96,48.09 161.25,48.09 164.81,51.64 164.81,53.67 189.44,78.31 v1(191.82,78.31)
  Bottom Layer w0.254: v1(158.2,47.32) 158.2,44.78 154.9,41.48 154.39,41.48 U1.15 ; v1(191.82,78.31) 198.93,85.42 202.48,85.42 203.75,84.15 207.82,84.15 U6#10.1

## Copper pours and planes (outline as drawn; the poured copper is in the pictures)
GND on Top Layer: -3.49,101.4 291.78,101.4 291.78,-4.39 -3.49,-4.39

## Text on the board
Bottom Layer: 3 | led1 | 8 | led3 | background led | 3.3v | gnd | out | cizhou right | cizhou down | cizhou left | Hitboard Pro v2.4 / Designed by 搅局
Top Silkscreen Layer: SELECT | START
